# EAGLE schematic HITB_AMS_V1.3 (EAGLE 8.7.0)
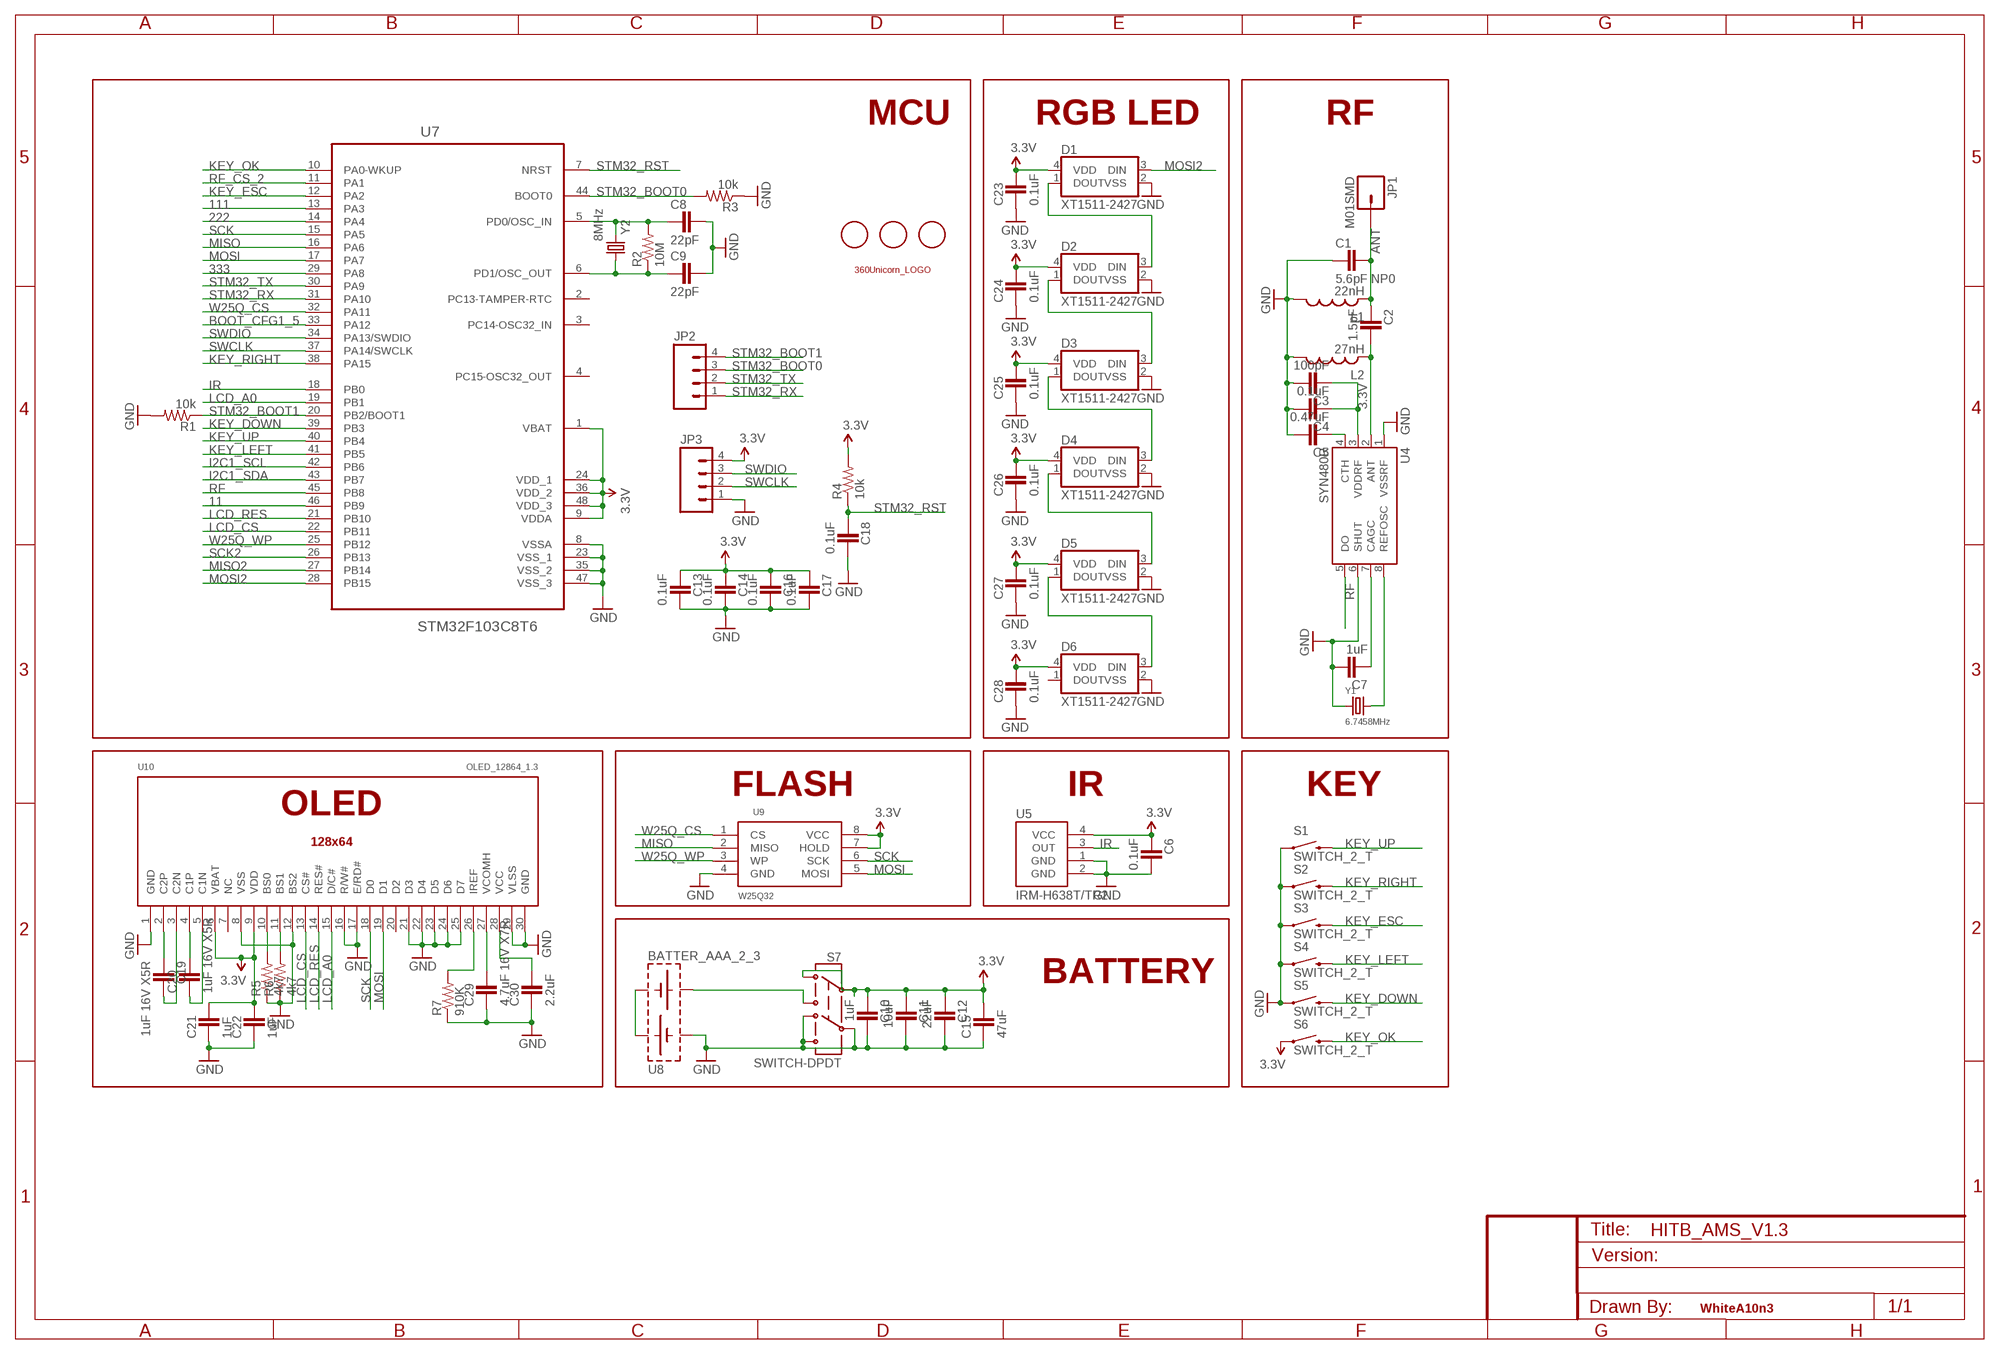
[diagram p0: schematic, sheet 1]

## Parts
C1  5.6pF NP0  CAP0603  [0603-CAP]
C2  1.5pF  CAP0603  [0603-CAP]
C3  100pF  CAP0603  [0603-CAP]
C4  0.1uF  CAP0603  [0603-CAP]
C5  0.47uF  CAP0603  [0603-CAP]
C6  0.1uF  CAP0603  [0603-CAP]
C7  1uF  CAP0603  [0603-CAP]
C8  22pF  CAP0603  [0603-CAP]
C9  22pF  CAP0603  [0603-CAP]
C10  1uF  CAP0603  [0603-CAP]
C11  10uF  CAP0603  [0603-CAP]
C12  22uF  CAP0603  [0603-CAP]
C13  0.1uF  CAP0603  [0603-CAP]
C14  0.1uF  CAP0603  [0603-CAP]
C15  47uF  CAP1206  [1206]
C16  0.1uF  CAP0603  [0603-CAP]
C17  0.1uF  CAP0603  [0603-CAP]
C18  0.1uF  CAP0603  [0603-CAP]
C19  1uF 16V X5R  CAP0603  [0603-CAP]
C20  1uF 16V X5R  CAP0603  [0603-CAP]
C21  1uF  CAP0603  [0603-CAP]
C22  1uF  CAP0603  [0603-CAP]
C23  0.1uF  CAP0603  [0603-CAP]
C24  0.1uF  CAP0603  [0603-CAP]
C25  0.1uF  CAP0603  [0603-CAP]
C26  0.1uF  CAP0603  [0603-CAP]
C27  0.1uF  CAP0603  [0603-CAP]
C28  0.1uF  CAP0603  [0603-CAP]
C29  4.7uF 16V X7R  CAP0603  [0603-CAP]
C30  2.2uF  CAP0603  [0603-CAP]
D1  XT1511-2427  [RGB_2427]
D2  XT1511-2427  [RGB_2427]
D3  XT1511-2427  [RGB_2427]
D4  XT1511-2427  [RGB_2427]
D5  XT1511-2427  [RGB_2427]
D6  XT1511-2427  [RGB_2427]
JP1  M01SMD  [LUXEON-PAD]
JP2  M04_TEST_2  [1X04_TEST_2]
JP3  M04_TEST_2  [1X04_TEST_2]
L1  22nH  INDUCTOR0603  [0603]
L2  27nH  INDUCTOR0603  [0603]
R1  10k  RESISTOR0603-RES  [0603-RES]
R2  10M  RESISTOR0603-RES  [0603-RES]
R3  10k  RESISTOR0603-RES  [0603-RES]
R4  10k  RESISTOR0603-RES  [0603-RES]
R5  4k7  RESISTOR0603-RES  [0603-RES]
R6  4k7  RESISTOR0603-RES  [0603-RES]
R7  910K  RESISTOR0603-RES  [0603-RES]
S1  SWITCH_2_T  [BUTTON_TSSURX]
S2  SWITCH_2_T  [BUTTON_TSSURX]
S3  SWITCH_2_T  [BUTTON_TSSURX]
S4  SWITCH_2_T  [BUTTON_TSSURX]
S5  SWITCH_2_T  [BUTTON_TSSURX]
S6  SWITCH_2_T  [BUTTON_TSSURX]
S7  SWITCH-DPDT  [MSS22D18]
U1  FIDUCIALMOUNT  [FIDUCIA-MOUNT]
U2  FIDUCIALMOUNT  [FIDUCIA-MOUNT]
U3  FIDUCIALMOUNT  [FIDUCIA-MOUNT]
U4  SYN480R  [SO08]
U5  IRM-H638T/TR2  IR_RECIVE  [IR_RECEIVE]
U6  360UNICORN_LOGO_0.8_STOP  [360UNICORN_S0.8]
U7  STM32F103C8T6  [TQFP48]
U8  BATTER_AAA_2_3  [BATTER_AAA_3]
U9  W25Q32  SPI_FLASH-X25XXSMD1  [SO08-EIAJ]
U10  OLED_12864_1.3  [OLED_12864_1.3]
Y1  6.7458MHz  CRYSTALSMD  [HC49UP]
Y2  8MHz  CRYSTAL_3225  [CRYSTAL-SMD-3225]

## Nets
3.3V: C3.2 C4.2 C6.2 C10.2 C11.2 C12.2 C13.2 C14.2 C15.1 C16.2 C17.2 C21.1 C22.1 C23.1 C24.1 C25.1 C26.1 C27.1 C28.1 D1.4(VDD) D2.4(VDD) D3.4(VDD) D4.4(VDD) D5.4(VDD) D6.4(VDD) JP3.4 R4.2 S6.P$1 S7.1 S7.2 U4.3(VDDRF) U5.4(VCC) U7.1(VBAT) U7.9(VDDA) U7.24(VDD_1) U7.36(VDD_2) U7.48(VDD_3) U9.7(HOLD) U9.8(VCC) U10.6(VBAT) U10.9(VDD)
11: U7.46(PB9)
111: U7.13(PA3)
222: U7.14(PA4)
333: U7.29(PA8)
ANT: C1.1 C2.2 JP1.P$1 L1.1
BOOT_CFG1_5: U7.33(PA12)
GND: C1.2 C3.1 C4.1 C5.1 C6.1 C7.1 C8.1 C9.1 C10.1 C11.1 C12.1 C13.1 C14.1 C15.2 C16.1 C17.1 C18.1 C21.2 C22.2 C23.2 C24.2 C25.2 C26.2 C27.2 C28.2 C29.2 C30.2 D1.2(VSS) D2.2(VSS) D3.2(VSS) D4.2(VSS) D5.2(VSS) D6.2(VSS) JP3.1 L1.2 L2.2 R1.2 R3.1 R5.1 R6.1 R7.1 S1.P$1 S2.P$1 S3.P$1 S4.P$1 S5.P$1 S7.4 S7.5 S7.6 U4.1(VSSRF) U4.6(SHUT) U5.1(GND) U5.2(GND) U7.8(VSSA) U7.23(VSS_1) U7.35(VSS_2) U7.47(VSS_3) U8.A- U9.4(GND) U10.1(GND) U10.8(VSS) U10.12(BS2) U10.16(R/W#) U10.17(E/RD#) U10.21(D3) U10.22(D4) U10.23(D5) U10.24(D6) U10.25(D7) U10.29(VLSS) U10.30(GND) Y1.1
I2C1_SCL: U7.42(PB6)
I2C1_SDA: U7.43(PB7)
IR: U5.3(OUT) U7.18(PB0)
KEY_DOWN: S5.P$2 U7.39(PB3)
KEY_ESC: S3.P$2 U7.12(PA2)
KEY_LEFT: S4.P$2 U7.41(PB5)
KEY_OK: S6.P$2 U7.10(PA0-WKUP)
KEY_RIGHT: S2.P$2 U7.38(PA15)
KEY_UP: S1.P$2 U7.40(PB4)
LCD_A0: U7.19(PB1) U10.15(D/C#)
LCD_CS: U7.22(PB11) U10.13(CS#)
LCD_RES: U7.21(PB10) U10.14(RES#)
MISO: U7.16(PA6) U9.2(MISO)
MISO2: U7.27(PB14)
MOSI: U7.17(PA7) U9.5(MOSI) U10.19(D1)
MOSI2: D1.3(DIN) U7.28(PB15)
N$1: D3.1(DOUT) D4.3(DIN)
N$2: C8.2 R2.2 U7.5(PD0/OSC_IN) Y2.1
N$3: R5.2 U10.10(BS0)
N$4: C9.2 R2.1 U7.6(PD1/OSC_OUT) Y2.3
N$5: U8.A+ U8.B-
N$6: D4.1(DOUT) D5.3(DIN)
N$8: D5.1(DOUT) D6.3(DIN)
N$14: S7.3 U8.B+
N$15: C29.1 U10.27(VCOMH)
N$16: C19.2 U10.2(C2P)
N$17: C19.1 U10.3(C2N)
N$18: C20.1 U10.4(C1P)
N$19: C20.2 U10.5(C1N)
N$21: C30.1 U10.28(VCC)
N$22: R7.2 U10.26(IREF)
N$23: R6.2 U10.11(BS1)
N$25: C2.1 L2.1 U4.2(ANT)
N$33: C5.2 U4.4(CTH)
N$34: C7.2 U4.7(CAGC)
N$35: U4.8(REFOSC) Y1.2
N$53: D2.1(DOUT) D3.3(DIN)
N$65: D1.1(DOUT) D2.3(DIN)
RF: U4.5(DO) U7.45(PB8)
RF_CS_2: U7.11(PA1)
SCK: U7.15(PA5) U9.6(SCK) U10.18(D0)
SCK2: U7.26(PB13)
STM32_BOOT0: JP2.3 R3.2 U7.44(BOOT0)
STM32_BOOT1: JP2.4 R1.1 U7.20(PB2/BOOT1)
STM32_RST: C18.2 R4.1 U7.7(NRST)
STM32_RX: JP2.1 U7.31(PA10)
STM32_TX: JP2.2 U7.30(PA9)
SWCLK: JP3.2 U7.37(PA14/SWCLK)
SWDIO: JP3.3 U7.34(PA13/SWDIO)
W25Q_CS: U7.32(PA11) U9.1(CS)
W25Q_WP: U7.25(PB12) U9.3(WP)
Unconnected: D6.1(DOUT) U7.2(PC13-TAMPER-RTC) U7.3(PC14-OSC32_IN) U7.4(PC15-OSC32_OUT) U10.7(NC) U10.20(D2)

## Notes on the sheet
- MCU | RGB LED | RF
- FLASH | IR | KEY
- BATTERY
- WhiteA10n3

## Library data of the parts
C1-C30 = 2SparkFun:CAP: Capacitor Standard 0603 ceramic capacitor, and 0.1" leaded capacitor.
D1-D6 = 2SparkFun:XT1511
JP1 = 2SparkFun:M01: Header 1 Standard 1-pin 0.1" header. Use with straight break away headers (SKU : PRT-00116), right angle break away headers (PRT-00553), swiss pins (PRT-00743), machine pins (PRT-00117), and female headers (PRT-00115).
JP2 JP3 = 2SparkFun:M04: Header 4 Standard 4-pin 0.1" header. Use with straight break away headers (SKU : PRT-00116), right angle break away headers (PRT-00553), swiss pins (PRT-00743), machine pins (PRT-00117), and female headers (PRT-00115). Molex polarized connector foot print use with SKU : PRT-08231 with associated crimp pins and housings. 1MM SMD Version SKU: PRT-10208
L1 L2 = 2SparkFun:INDUCTOR: Inductors Basic Inductor/Choke - 0603 and 1206. Footprints are not proven and vary greatly between part numbers.
R1-R7 = 2SparkFun:RESISTOR: Resistor Basic schematic elements and footprints for 0603, 1206, and PTH resistors.
S1-S6 = 2SparkFun:SWITCH_2
S7 = 0SparkFun:SWITCH-DPDT: DPDT Version of the COM-00597
U1-U3 = 2SparkFun:FIDUCIALMOUNT
U4 = 2SparkFun:SYN480R
U5 = 2SparkFun:IR_RECIVE
U6 = 2SparkFun:360UNICORN_LOGO
U7 = 2SparkFun:STM32F103C8T6
U8 = 2SparkFun:BATTER_AAA_2
U9 = 2SparkFun:SPI_FLASH-X25XX: 8pin SPI Flash series x25xx. Works with devices like W25X32 and BR25L32
U10 = 2SparkFun:OLED_12864
Y1 Y2 = 2SparkFun:CRYSTAL: Crystals Various standard crystals. Proven footprints. Spark Fun Electronics SKU : COM-00534

## Net classes
0 default: width 0.254 mm, clearance 0.254 mm